# Altium schematic sheet pioneer_2-bluepill_eletronic_wrapper-supply.SchDoc
size A; SheetNumber: 2; SheetTotal: 3
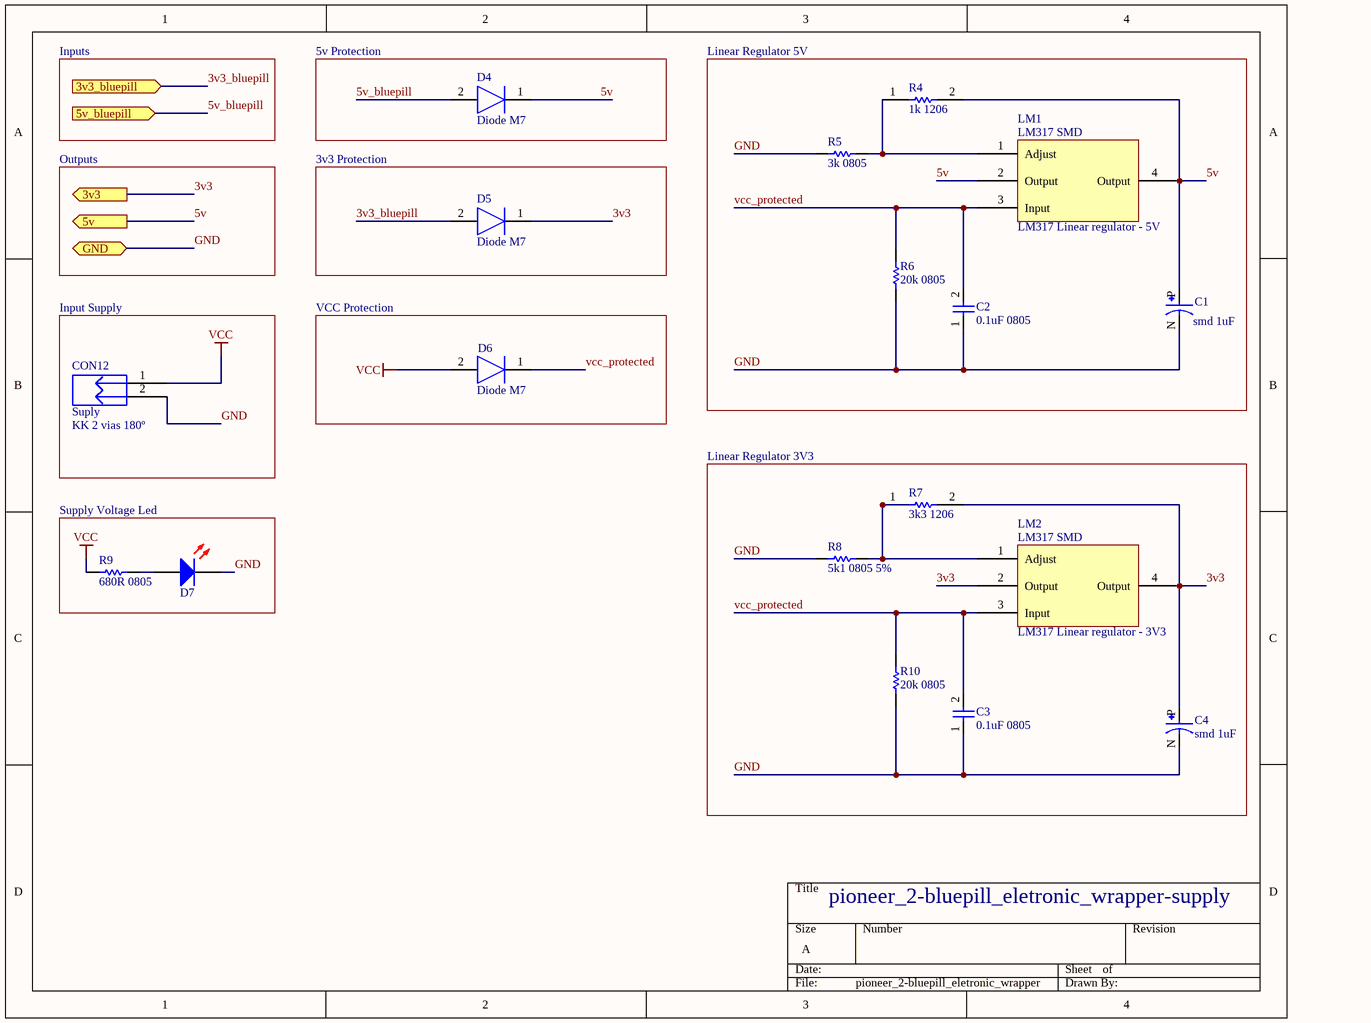
[diagram p0: pioneer_2-bluepill_eletronic_wrapper-supply.SchDoc]

## Parts
C1  smd 1uF  [CAP_EEE1HA2R2SR]
C2  0.1uF 0805  [CAPACITOR 0805]
C3  0.1uF 0805  [CAPACITOR 0805]
C4  smd 1uF  [CAP_EEE1HA2R2SR]
CON12  Suply  Valor: KK 2 vias 180º  [KK_2VIAS_180º]
D4  Diode M7  [DIOM505270X240]
D5  Diode M7  [DIOM505270X240]
D6  Diode M7  [DIOM505270X240]
D7  LED 3MM RED  [LED RED]  (value not drawn)
LM1  LM317 Linear regulator - 5V  [SOT-223-2]
LM2  LM317 Linear regulator - 3V3  [SOT-223-2]
R4  1k 1206  [RESC3216X60N]
R5  3k 0805  [RESISTOR 0805]
R6  20k 0805  [RESISTOR 0805]
R7  3k3 1206  [RESC3216X60N]
R8  5k1 0805 5%  [RESISTOR 0805]
R9  680R 0805  [RESISTOR 0805]
R10  20k 0805  [RESISTOR 0805]

## Blocks framed on the sheet
5v Protection: D4
Linear Regulator 5V: C1 C2 LM1 R4-R6
3v3 Protection: D5
Input Supply: CON12
VCC Protection: D6
Linear Regulator 3V3: C3 C4 LM2 R7 R8 R10
Supply Voltage Led: D7 R9

## Ports
3v3 (out, see pioneer_2-bluepill_eletronic_wrapper[4C], pioneer_2-bluepill_eletronic_wrapper-communication[1A]), 3v3_bluepill (in, see pioneer_2-bluepill_eletronic_wrapper[3C]), 5v (out, see pioneer_2-bluepill_eletronic_wrapper[4C], pioneer_2-bluepill_eletronic_wrapper-communication[1A]), 5v_bluepill (in, see pioneer_2-bluepill_eletronic_wrapper[3C]), GND (bidir, see pioneer_2-bluepill_eletronic_wrapper[3C], pioneer_2-bluepill_eletronic_wrapper-communication[1A])

## Nets
VCC: CON12.1 D6.2(A) R9.2
3v3: C4.P D5.1(K) LM2.2(Output) LM2.4(Output) R7.2 ; port 3v3
3v3_bluepill: D5.2(A) ; port 3v3_bluepill
5v: C1.P D4.1(K) LM1.2(Output) LM1.4(Output) R4.2 ; port 5v
5v_bluepill: D4.2(A) ; port 5v_bluepill
GND: C1.N C2.1 C3.1 C4.N CON12.2 D7.2(K) R5.2 R6.2 R8.1 R10.2 ; port GND
vcc_protected: C2.2 C3.2 D6.1(K) LM1.3(Input) LM2.3(Input) R6.1 R10.1
NetD7_1: D7.1(A) R9.1
NetLM1_1: LM1.1(Adjust) R4.1 R5.1
NetLM2_1: LM2.1(Adjust) R7.1 R8.2

## Notes on the sheet
- Inputs
- Outputs
- pioneer_2-bluepill_eletronic_wrapper-supply
- (in symbol lm317 smd) LM317 SMD

## Library data of the parts
C1 C4 = Cap. Elet. smd 1uF 50V: Aluminum Organic Polymer Capacitors smd 50volts 1uF; Manufacturer_Name: Panasonic; Manufacturer_Part_Number: 16SEPC470M; Datasheet Link: http://industrial.panasonic.com/www-cgi/jvcr13pz.cgi?E+CI+4+AAB8010+16SEPC470M+8+WW; Height: 13mm; Mouser Part Number: 667-16SEPC470M; Mouser Price/Stock: https://www.mouser.co.uk/ProductDetail/Panasonic/16SEPC470M?qs=OE1iw1LrrPEdZuWyF2l%252B5w%3D%3D; Arrow Part Number: 16SEPC470M; Arrow Price/Stock: https://www.arrow.com/en/products/16sepc470m/panasonic
C2 C3 = CAP 0805: capacitor 0805; Manufacturer: PANASONIC ELECTRONIC COMPONENTS; Manufacturer Part Number: ERJ-3GEY0R00V; Product Range: AEC-Q200 ERJ3; Resistance: 0; Power Rating: 100; Voltage Rating: 75; Resistor Case Style: 0603 [1608 Metric]; Resistance (Ohms): 0.0; Tolerance: Jumper; Power (Watts): 0.1W, 1/10W; Type: Thick Film Resistors SMD; Brand: Panasonic; Qualification: AEC-Q200; RoHS: YES; Resistance Tolerance: -; Packaging: Cut Tape; MSL: -; ComponentLink1URL: http://www.farnell.com/cad/1697908.zip; ComponentLink1Description: http://www.farnell.com/cad/1697908.zip; ComponentLink2URL: http://www.farnell.com/datasheets/1678796.pdf; ComponentLink2Description: http://www.farnell.com/datasheets/1678796.pdf; Category: Resistors; Composition: Thick Film; Features: Automotive AEC-Q200; Temperature Coefficient: -; Operating Temperature: -55°C ~ 155°C; Package / Case: 0603 (1608 Metric); Supplier Device Package: 0603; Size / Dimension: 0.063" L x 0.031" W (1.60mm x 0.80mm); Height: 0.022" (0.55mm); Number of Terminations: 2; ComponentLink3URL: http://industrial.panasonic.com/www-cgi/jvcr13pz.cgi?E+PZ+3+AOA0001+ERJ3GEY0R00V+7+WW; ComponentLink3Description: http://industrial.panasonic.com/www-cgi/jvcr13pz.cgi?E+PZ+3+AOA0001+ERJ3GEY0R00V+7+WW; Supplier 1: Mouser; Stock 1: 1987085; Pricing 1: 1=0.160, 10=0.019, 100=0.013, 500=0.010, 1000=0.005, 5000=0.003 (AUD); Length: 1.6 mm; Operating Temperature Range: - 55 C to + 155 C; Product: Thick Film Resistors Zero-Ohm; Series: ERJ; Termination Style: SMD/SMT; Width: 0.8 mm; Case Code - in: 0603; Case Code - mm: 1608; RoHS - Mouser: E; Minimum Order Quantity: 1; Reeling: True; ComponentLink4URL: http://www.mouser.com/ds/2/315/AOA0000C84-947596.pdf; ComponentLink4Description: http://www.mouser.com/ds/2/315/AOA0000C84-947596.pdf; Supplier Part Number 1: 667-ERJ-3GEY0R00V
CON12 = KK_2.54_2vias: Conector KK 2.54mm 2 vias; Descrição: Conector KK 3 vias com passo 2.54mm; Encapsulamento: PTH - 180º; Modelo: 2 vias - 180º; Marca: *; Observação: *
D4-D6 = Diode M7: Diode, SMA, 1000V, 1A, 150°C; MF: Diotec Semiconductor; SnapEDA_Link: https://www.snapeda.com/parts/M7/Diotec/view-part/?ref=snap; Package: DO-214AC Diotec; Value: *; MP: M7; Check_prices: https://www.snapeda.com/parts/M7/Diotec/view-part/?ref=eda
D7 = LED 3MM RED: Manufacturer: Paralight; Manufacturer Part Number: IMP585; Wavelength Typ: 625; Forward Voltage: 2; Forward Current If: 20; Luminous Intensity: 3; LED Mounting: Through Hole; Lens Shape: Round; Viewing Angle: 60°; SVHC: No SVHC (15-Jun-2015); External Diameter: 2.9; External Length / Height: 4.6; Forward Voltage VF Max: 2.5; LED / Lamp Size: 3mm / T-1; LED Type: Standard; Lead Cross-section Depth: 0.5; Luminous Intensity @ If Min: 0.7; PIV Max: 5; Peak Forward Current: 7; Voltage Vf Typ: 2.2V<!--FANDB--><div class="features-and-benefits-container"><div class="features-and-benefits-description"><span class="features-benefits-value">The L-934LID from Kingbright is a through hole round shape high efficiency red colour LED. The device is made of gallium arsenide phosphide on gallium phosphide orange light emitting diode. This LED is widely used because of low power consumption, long life and solid state reliability.</span></div><div class="features-and-benefits-list"><ul class="features-and-benefits-list-list"><li class="features-and-benefits-list-item">Standard bulb size of T-1 (3mm)</li><li class="features-and-benefits-list-item">Reliable and rugged</li><li class="features-and-benefits-list-item">Viewing angle is 60°</li><li class="features-and-benefits-list-item">Luminous intensity of 3mcd at 2mA</li><li class="features-and-benefits-list-item">Forward voltage is 2.0V</li><li class="features-and-benefits-list-item">Forward current (If) is 20mA</li><li class="features-and-benefits-list-item">Dominant wavelength is 625nm at IF=20mA</li><li class="features-and-benefits-list-item">Peak wavelength is 627nm at IF=20; Supplier 1: Mult Comercial; RoHS: YES; Stock 1: 35260; Pricing 1: 1=0.15 (BRL); LED Colour: Red; Bulb Size: 3mm; Packaging: Each; MSL: -; Current If Luminous Intensity: 2; Dominant Wavelength: 625; Forward Current If Max: 20; Lead Cross-section Width: 0.5; Lead Spacing: 2.54; Luminous Intensity Typ: 3; Mounting Type: PCB Through Hole; No. of Pins: 2; Operating Temperature Max: 85; Operating Temperature Min: -40; Operating Temperature Range: -40°C to +85; Peak Wavelength: 625; ComponentLink1URL: http://loja.multcomercial.com.br/led-3mm-vermelho-difuso-l-314hd-paralight.html; ComponentLink1Description: http://loja.multcomercial.com.br/led-3mm-vermelho-difuso-l-314hd-paralight.html; Supplier Part Number 1: Led 3mm Vermelho Difuso L-314HD - Paralight
LM1 LM2 = lm317 smd: SOT223
R4 R7 = RES 1206: RES 1206 5%; Manufacturer_Name: Vishay; Manufacturer_Part_Number: CRCW12064K70FKEA; Datasheet Link: http://docs-emea.rs-online.com/webdocs/13ec/0900766b813ecc08.pdf; Height: 0.6mm; Mouser Part Number: 71-CRCW1206-4.7K-E3; Mouser Price/Stock: https://www.mouser.co.uk/ProductDetail/Vishay-Dale/CRCW12064K70FKEA?qs=1vm4qhDHCvlKJmatsKzyFQ%3D%3D; Arrow Part Number: CRCW12064K70FKEA; Arrow Price/Stock: https://www.arrow.com/en/products/crcw12064k70fkea/vishay
R5 R6 R8-R10 = RES 0805 5%: 0805; Manufacturer: PANASONIC ELECTRONIC COMPONENTS; Manufacturer Part Number: ERJ-3GEY0R00V; Product Range: AEC-Q200 ERJ3; Resistance: 0; Power Rating: 100; Voltage Rating: 75; Resistor Case Style: 0603 [1608 Metric]; Resistance (Ohms): 0.0; Tolerance: Jumper; Power (Watts): 0.1W, 1/10W; Brand: Panasonic; Qualification: AEC-Q200; RoHS: YES; Resistance Tolerance: -; Packaging: Cut Tape; MSL: -; ComponentLink1URL: http://www.farnell.com/cad/1697908.zip; ComponentLink1Description: http://www.farnell.com/cad/1697908.zip; ComponentLink2URL: http://www.farnell.com/datasheets/1678796.pdf; ComponentLink2Description: http://www.farnell.com/datasheets/1678796.pdf; Category: Resistors; Composition: Thick Film; Features: Automotive AEC-Q200; Temperature Coefficient: -; Operating Temperature: -55°C ~ 155°C; Package / Case: 0603 (1608 Metric); Supplier Device Package: 0603; Size / Dimension: 0.063" L x 0.031" W (1.60mm x 0.80mm); Height: 0.022" (0.55mm); Number of Terminations: 2; ComponentLink3URL: http://industrial.panasonic.com/www-cgi/jvcr13pz.cgi?E+PZ+3+AOA0001+ERJ3GEY0R00V+7+WW; ComponentLink3Description: http://industrial.panasonic.com/www-cgi/jvcr13pz.cgi?E+PZ+3+AOA0001+ERJ3GEY0R00V+7+WW; Supplier 1: Mouser; Stock 1: 1987085; Pricing 1: 1=0.160, 10=0.019, 100=0.013, 500=0.010, 1000=0.005, 5000=0.003 (AUD); Length: 1.6 mm; Operating Temperature Range: - 55 C to + 155 C; Product: Thick Film Resistors Zero-Ohm; Series: ERJ; Termination Style: SMD/SMT; Type: Thick Film Resistors SMD; Width: 0.8 mm; Case Code - in: 0603; Case Code - mm: 1608; RoHS - Mouser: E; Minimum Order Quantity: 1; Reeling: True; ComponentLink4URL: http://www.mouser.com/ds/2/315/AOA0000C84-947596.pdf; ComponentLink4Description: http://www.mouser.com/ds/2/315/AOA0000C84-947596.pdf; Supplier Part Number 1: 667-ERJ-3GEY0R00V